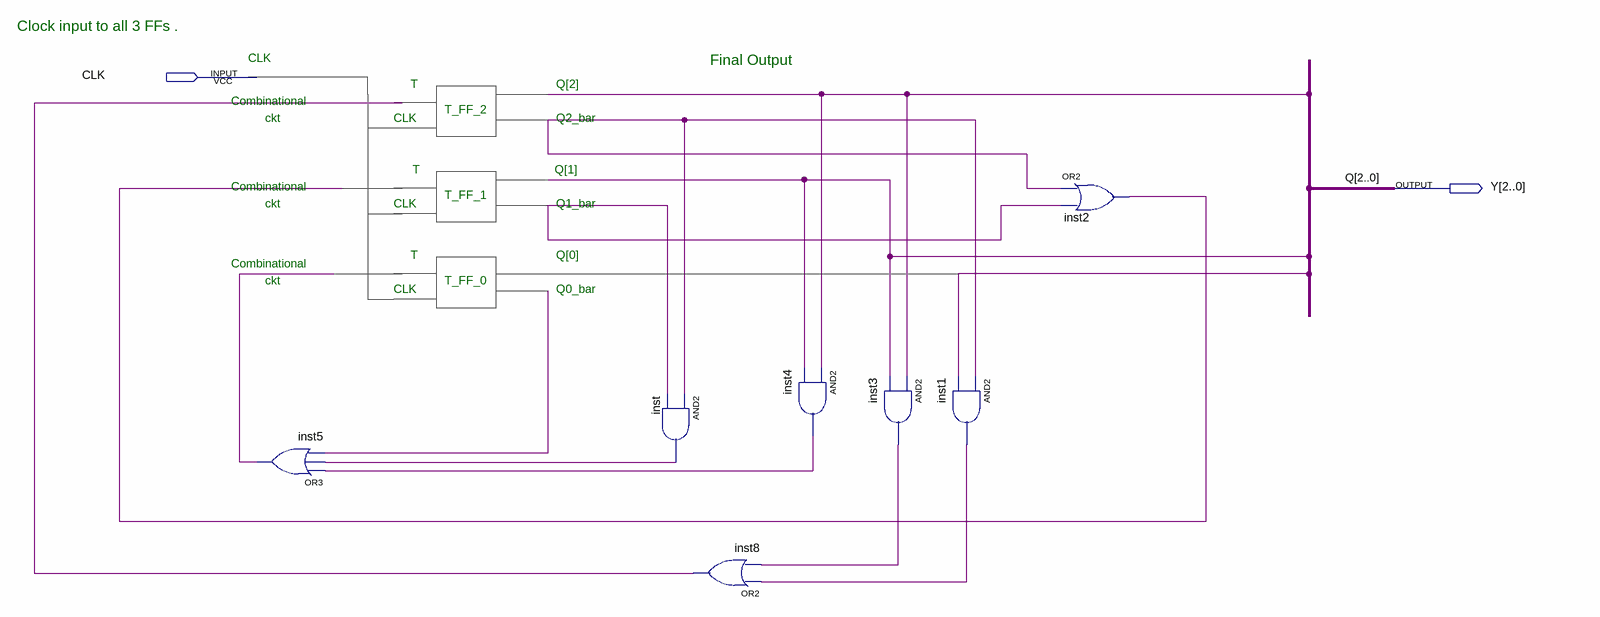
[diagram p0: schematic sheet]
// Quartus schematic seq_block.bdf as structural Verilog: 7 symbols, 2 pins
module seq_block (
  input  CLK,
  output [2:0] Y
);

  wire inst1_out, inst2_out, inst3_out, inst4_out, inst5_out, inst8_out, inst_out, undriven, undriven_2,
       undriven_3, undriven_4, undriven_5, undriven_6;

  or inst5 (inst5_out, inst4_out, inst_out, undriven_2);
  and inst (inst_out, undriven_3, undriven);
  or inst8 (inst8_out, inst1_out, inst3_out);
  and inst4 (inst4_out, undriven_5, undriven_6);
  and inst3 (inst3_out, undriven_5, undriven_6);
  and inst1 (inst1_out, undriven_3, undriven_4);
  or inst2 (inst2_out, undriven_3, undriven);

  // Other names for the same wires on the sheet: Q[2:0] = Y

  // Notes on the sheet:
  //   Clock input to all 3 FFs .
  //   CLK
  //   Final Output
  //   T
  //   Q[2]
  //   Combinational
  //   T_FF_2
  //   ckt
  //   CLK
  //   Q2_bar
  //      T
  //     Q[1]
  //   Combinational
  //   T_FF_1
  //   ckt
  //   CLK
  //   Q1_bar
  //   T
  //   Q[0]
  //   Combinational
  //   ckt
  //   T_FF_0
  //   CLK
  //   Q0_bar
endmodule
